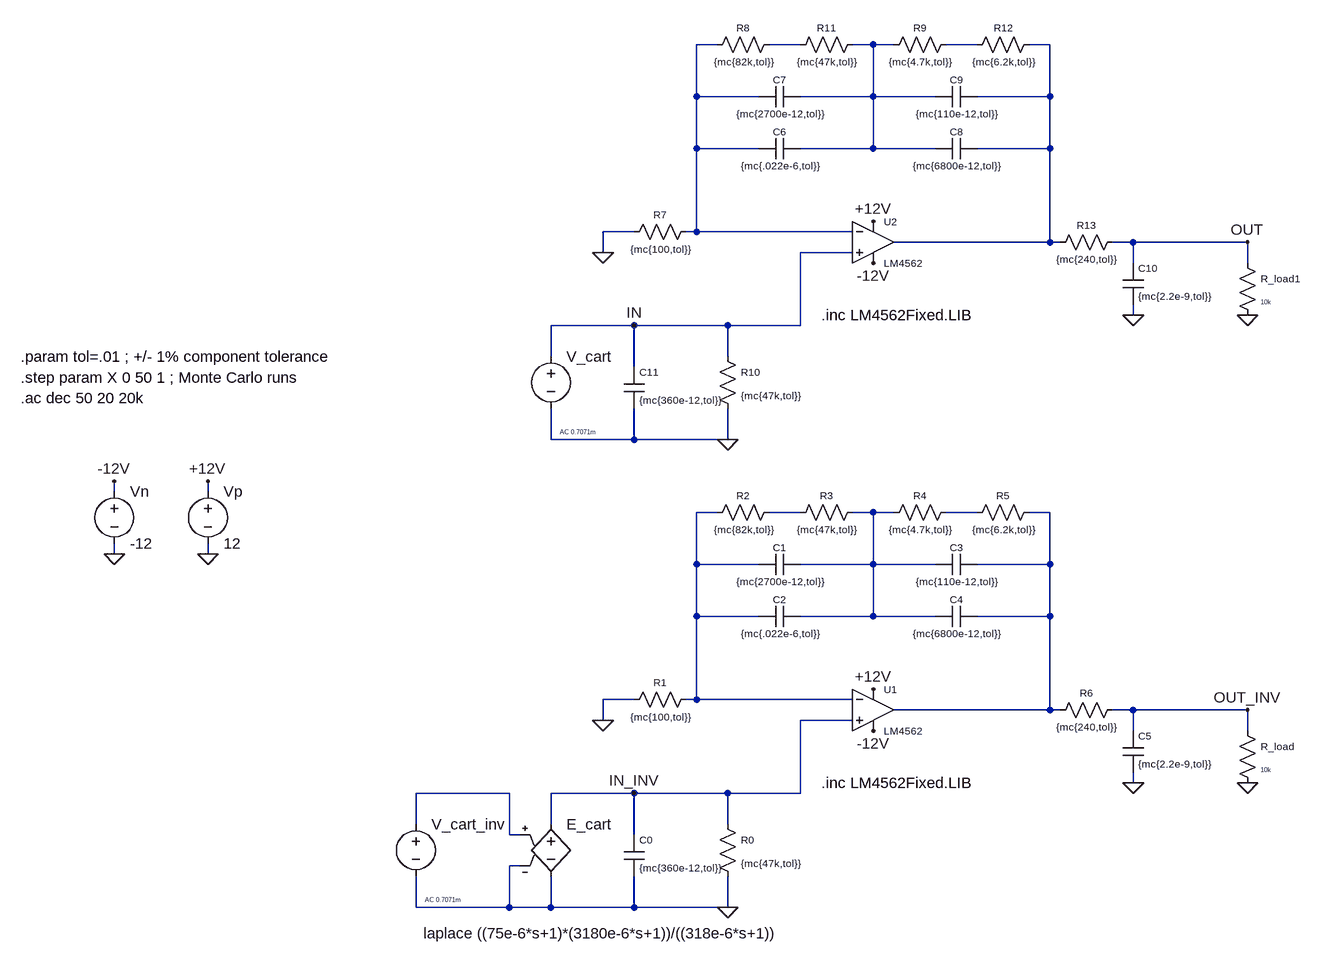
[diagram p0: schematic Vestax PDX-2000 Phono v1.1.asc]
Vestax PDX-2000 Phono v1.1.asc, the LTspice schematic file:
Version 4
SHEET 1 1280 680
WIRE -752 -1392 -784 -1392
WIRE -624 -1392 -672 -1392
WIRE -512 -1392 -544 -1392
WIRE -480 -1392 -512 -1392
WIRE -352 -1392 -400 -1392
WIRE -240 -1392 -272 -1392
WIRE -784 -1312 -784 -1392
WIRE -688 -1312 -784 -1312
WIRE -512 -1312 -512 -1392
WIRE -512 -1312 -624 -1312
WIRE -416 -1312 -512 -1312
WIRE -240 -1312 -240 -1392
WIRE -240 -1312 -352 -1312
WIRE -784 -1232 -784 -1312
WIRE -688 -1232 -784 -1232
WIRE -512 -1232 -512 -1312
WIRE -512 -1232 -624 -1232
WIRE -416 -1232 -512 -1232
WIRE -240 -1232 -240 -1312
WIRE -240 -1232 -352 -1232
WIRE -880 -1104 -928 -1104
WIRE -784 -1104 -784 -1232
WIRE -784 -1104 -800 -1104
WIRE -544 -1104 -784 -1104
WIRE -240 -1088 -240 -1232
WIRE -240 -1088 -480 -1088
WIRE -224 -1088 -240 -1088
WIRE -112 -1088 -144 -1088
WIRE 64 -1088 -112 -1088
WIRE -928 -1072 -928 -1104
WIRE -544 -1072 -624 -1072
WIRE -112 -1056 -112 -1088
WIRE 64 -1056 64 -1088
WIRE -112 -976 -112 -992
WIRE -880 -960 -1008 -960
WIRE -736 -960 -880 -960
WIRE -624 -960 -624 -1072
WIRE -624 -960 -736 -960
WIRE -1008 -912 -1008 -960
WIRE -736 -912 -736 -960
WIRE -880 -896 -880 -960
WIRE -1008 -784 -1008 -832
WIRE -880 -784 -880 -832
WIRE -880 -784 -1008 -784
WIRE -736 -784 -736 -832
WIRE -736 -784 -880 -784
WIRE -1680 -704 -1680 -720
WIRE -1536 -704 -1536 -720
WIRE -752 -672 -784 -672
WIRE -624 -672 -672 -672
WIRE -512 -672 -544 -672
WIRE -480 -672 -512 -672
WIRE -352 -672 -400 -672
WIRE -240 -672 -272 -672
WIRE -1680 -608 -1680 -624
WIRE -1536 -608 -1536 -624
WIRE -784 -592 -784 -672
WIRE -688 -592 -784 -592
WIRE -512 -592 -512 -672
WIRE -512 -592 -624 -592
WIRE -416 -592 -512 -592
WIRE -240 -592 -240 -672
WIRE -240 -592 -352 -592
WIRE -784 -512 -784 -592
WIRE -688 -512 -784 -512
WIRE -512 -512 -512 -592
WIRE -512 -512 -624 -512
WIRE -416 -512 -512 -512
WIRE -240 -512 -240 -592
WIRE -240 -512 -352 -512
WIRE -880 -384 -928 -384
WIRE -784 -384 -784 -512
WIRE -784 -384 -800 -384
WIRE -544 -384 -784 -384
WIRE -240 -368 -240 -512
WIRE -240 -368 -480 -368
WIRE -224 -368 -240 -368
WIRE -112 -368 -144 -368
WIRE 64 -368 -112 -368
WIRE -928 -352 -928 -384
WIRE -544 -352 -624 -352
WIRE -112 -336 -112 -368
WIRE 64 -336 64 -368
WIRE -112 -256 -112 -272
WIRE -1072 -240 -1216 -240
WIRE -880 -240 -1008 -240
WIRE -736 -240 -880 -240
WIRE -624 -240 -624 -352
WIRE -624 -240 -736 -240
WIRE -1216 -192 -1216 -240
WIRE -1008 -192 -1008 -240
WIRE -736 -192 -736 -240
WIRE -1072 -176 -1072 -240
WIRE -1056 -176 -1072 -176
WIRE -880 -176 -880 -240
WIRE -1056 -128 -1072 -128
WIRE -1216 -64 -1216 -112
WIRE -1072 -64 -1072 -128
WIRE -1072 -64 -1216 -64
WIRE -1008 -64 -1008 -112
WIRE -1008 -64 -1072 -64
WIRE -880 -64 -880 -112
WIRE -880 -64 -1008 -64
WIRE -736 -64 -736 -112
WIRE -736 -64 -880 -64
FLAG -1536 -608 0
FLAG -1680 -608 0
FLAG -928 -352 0
FLAG 64 -368 OUT_INV
FLAG -736 -64 0
FLAG -880 -240 IN_INV
FLAG 64 -256 0
FLAG -112 -256 0
FLAG -1536 -720 +12V
FLAG -512 -400 +12V
FLAG -1680 -720 -12V
FLAG -512 -336 -12V
FLAG -928 -1072 0
FLAG 64 -1088 OUT
FLAG -736 -784 0
FLAG -880 -960 IN
FLAG 64 -976 0
FLAG -112 -976 0
FLAG -512 -1120 +12V
FLAG -512 -1056 -12V
SYMBOL Opamps\\opamp2 -512 -432 R0
WINDOW 0 16 32 Left 1
WINDOW 3 16 96 Left 1
SYMATTR InstName U1
SYMATTR Value LM4562
SYMBOL res -784 -400 R90
WINDOW 0 0 56 VBottom 1
WINDOW 3 32 56 VTop 1
SYMATTR InstName R1
SYMATTR Value {mc{100,tol}}
SYMBOL voltage -1536 -720 R0
SYMATTR InstName Vp
SYMATTR Value 12
SYMBOL voltage -1680 -720 R0
WINDOW 123 0 0 Left 0
WINDOW 39 0 0 Left 0
SYMATTR InstName Vn
SYMATTR Value -12
SYMBOL res -656 -688 R90
WINDOW 0 0 56 VBottom 1
WINDOW 3 32 56 VTop 1
SYMATTR InstName R2
SYMATTR Value {mc{82k,tol}}
SYMBOL res -384 -688 R90
WINDOW 0 0 56 VBottom 1
WINDOW 3 32 56 VTop 1
SYMATTR InstName R4
SYMATTR Value {mc{4.7k,tol}}
SYMBOL res -752 -208 R0
WINDOW 0 36 40 Left 1
WINDOW 3 36 76 Left 1
SYMATTR InstName R0
SYMATTR Value {mc{47k,tol}}
SYMBOL e -1008 -208 R0
WINDOW 3 -196 184 Left 2
SYMATTR Value laplace ((75e-6*s+1)*(3180e-6*s+1))/((318e-6*s+1))
SYMATTR InstName E_cart
SYMBOL voltage -1216 -208 R0
WINDOW 123 14 132 Left 0
WINDOW 39 0 0 Left 0
WINDOW 3 14 160 Left 0
SYMATTR Value2 AC 0.7071m
SYMATTR Value ""
SYMATTR InstName V_cart_inv
SYMBOL res 48 -352 R0
WINDOW 0 36 40 Left 1
WINDOW 3 36 76 Left 0
SYMATTR InstName R_load
SYMATTR Value 10k
SYMBOL cap -624 -528 R90
WINDOW 0 0 32 VBottom 1
WINDOW 3 32 32 VTop 1
SYMATTR InstName C2
SYMATTR Value {mc{.022e-6,tol}}
SYMBOL cap -624 -608 R90
WINDOW 0 0 32 VBottom 1
WINDOW 3 32 32 VTop 1
SYMATTR InstName C1
SYMATTR Value {mc{2700e-12,tol}}
SYMBOL cap -352 -528 R90
WINDOW 0 0 32 VBottom 1
WINDOW 3 32 32 VTop 1
SYMATTR InstName C4
SYMATTR Value {mc{6800e-12,tol}}
SYMBOL cap -352 -608 R90
WINDOW 0 0 32 VBottom 1
WINDOW 3 32 32 VTop 1
SYMATTR InstName C3
SYMATTR Value {mc{110e-12,tol}}
SYMBOL res -528 -688 R90
WINDOW 0 0 56 VBottom 1
WINDOW 3 32 56 VTop 1
SYMATTR InstName R3
SYMATTR Value {mc{47k,tol}}
SYMBOL res -256 -688 R90
WINDOW 0 0 56 VBottom 1
WINDOW 3 32 56 VTop 1
SYMATTR InstName R5
SYMATTR Value {mc{6.2k,tol}}
SYMBOL res -128 -384 R90
WINDOW 0 0 56 VBottom 1
WINDOW 3 32 56 VTop 1
SYMATTR InstName R6
SYMATTR Value {mc{240,tol}}
SYMBOL cap -128 -336 R0
WINDOW 3 24 51 Left 1
WINDOW 0 24 8 Left 1
SYMATTR Value {mc{2.2e-9,tol}}
SYMATTR InstName C5
SYMBOL cap -896 -176 R0
WINDOW 3 24 51 Left 1
WINDOW 0 24 8 Left 1
SYMATTR Value {mc{360e-12,tol}}
SYMATTR InstName C0
SYMBOL Opamps\\opamp2 -512 -1152 R0
WINDOW 0 16 32 Left 1
WINDOW 3 16 96 Left 1
SYMATTR InstName U2
SYMATTR Value LM4562
SYMBOL res -784 -1120 R90
WINDOW 0 0 56 VBottom 1
WINDOW 3 32 56 VTop 1
SYMATTR InstName R7
SYMATTR Value {mc{100,tol}}
SYMBOL res -656 -1408 R90
WINDOW 0 0 56 VBottom 1
WINDOW 3 32 56 VTop 1
SYMATTR InstName R8
SYMATTR Value {mc{82k,tol}}
SYMBOL res -384 -1408 R90
WINDOW 0 0 56 VBottom 1
WINDOW 3 32 56 VTop 1
SYMATTR InstName R9
SYMATTR Value {mc{4.7k,tol}}
SYMBOL res -752 -928 R0
WINDOW 0 36 40 Left 1
WINDOW 3 36 76 Left 1
SYMATTR InstName R10
SYMATTR Value {mc{47k,tol}}
SYMBOL res 48 -1072 R0
WINDOW 0 36 40 Left 1
WINDOW 3 36 76 Left 0
SYMATTR InstName R_load1
SYMATTR Value 10k
SYMBOL cap -624 -1248 R90
WINDOW 0 0 32 VBottom 1
WINDOW 3 32 32 VTop 1
SYMATTR InstName C6
SYMATTR Value {mc{.022e-6,tol}}
SYMBOL cap -624 -1328 R90
WINDOW 0 0 32 VBottom 1
WINDOW 3 32 32 VTop 1
SYMATTR InstName C7
SYMATTR Value {mc{2700e-12,tol}}
SYMBOL cap -352 -1248 R90
WINDOW 0 0 32 VBottom 1
WINDOW 3 32 32 VTop 1
SYMATTR InstName C8
SYMATTR Value {mc{6800e-12,tol}}
SYMBOL cap -352 -1328 R90
WINDOW 0 0 32 VBottom 1
WINDOW 3 32 32 VTop 1
SYMATTR InstName C9
SYMATTR Value {mc{110e-12,tol}}
SYMBOL res -528 -1408 R90
WINDOW 0 0 56 VBottom 1
WINDOW 3 32 56 VTop 1
SYMATTR InstName R11
SYMATTR Value {mc{47k,tol}}
SYMBOL res -256 -1408 R90
WINDOW 0 0 56 VBottom 1
WINDOW 3 32 56 VTop 1
SYMATTR InstName R12
SYMATTR Value {mc{6.2k,tol}}
SYMBOL res -128 -1104 R90
WINDOW 0 0 56 VBottom 1
WINDOW 3 32 56 VTop 1
SYMATTR InstName R13
SYMATTR Value {mc{240,tol}}
SYMBOL cap -128 -1056 R0
WINDOW 3 24 51 Left 1
WINDOW 0 24 8 Left 1
SYMATTR Value {mc{2.2e-9,tol}}
SYMATTR InstName C10
SYMBOL cap -896 -896 R0
WINDOW 3 24 51 Left 1
WINDOW 0 24 8 Left 1
SYMATTR Value {mc{360e-12,tol}}
SYMATTR InstName C11
SYMBOL voltage -1008 -928 R0
WINDOW 123 14 132 Left 0
WINDOW 39 0 0 Left 0
WINDOW 3 14 160 Left 0
SYMATTR Value2 AC 0.7071m
SYMATTR Value ""
SYMATTR InstName V_cart
TEXT -592 -256 Left 2 !.inc LM4562Fixed.LIB
TEXT -1824 -848 Left 2 !.ac dec 50 20 20k
TEXT -1824 -880 Left 2 !.step param X 0 50 1 ; Monte Carlo runs
TEXT -1824 -912 Left 2 !.param tol=.01 ; +/- 1% component tolerance
TEXT -592 -976 Left 2 !.inc LM4562Fixed.LIB

The netlist it stands for:
* Vestax PDX-2000 Phono v1.1.asc
XU1 IN_INV N006 +12V -12V N010 LM4562  ; pins In+ In- V+ V- OUT
R1 N006 0 {mc{100,tol}}
Vp +12V 0 12
Vn -12V 0 -12
R2 N007 N006 {mc{82k,tol}}
R4 N009 N008 {mc{4.7k,tol}}
R0 IN_INV 0 {mc{47k,tol}}
E_cart IN_INV 0 N011 0 laplace ((75e-6*s+1)*(3180e-6*s+1))/((318e-6*s+1))
V_cart_inv N011 0 AC 0.7071m
R_load OUT_INV 0 10k
C2 N008 N006 {mc{.022e-6,tol}}
C1 N008 N006 {mc{2700e-12,tol}}
C4 N010 N008 {mc{6800e-12,tol}}
C3 N010 N008 {mc{110e-12,tol}}
R3 N008 N007 {mc{47k,tol}}
R5 N010 N009 {mc{6.2k,tol}}
R6 OUT_INV N010 {mc{240,tol}}
C5 OUT_INV 0 {mc{2.2e-9,tol}}
C0 IN_INV 0 {mc{360e-12,tol}}
XU2 IN N001 +12V -12V N005 LM4562  ; pins In+ In- V+ V- OUT
R7 N001 0 {mc{100,tol}}
R8 N002 N001 {mc{82k,tol}}
R9 N004 N003 {mc{4.7k,tol}}
R10 IN 0 {mc{47k,tol}}
R_load1 OUT 0 10k
C6 N003 N001 {mc{.022e-6,tol}}
C7 N003 N001 {mc{2700e-12,tol}}
C8 N005 N003 {mc{6800e-12,tol}}
C9 N005 N003 {mc{110e-12,tol}}
R11 N003 N002 {mc{47k,tol}}
R12 N005 N004 {mc{6.2k,tol}}
R13 OUT N005 {mc{240,tol}}
C10 OUT 0 {mc{2.2e-9,tol}}
C11 IN 0 {mc{360e-12,tol}}
V_cart IN 0 AC 0.7071m
.inc LM4562Fixed.LIB
.ac dec 50 20 20k
.step param X 0 50 1 ; Monte Carlo runs
.param tol=.01 ; +/- 1% component tolerance
.inc LM4562Fixed.LIB
.backanno
.end